# Altium schematic sheet PowCarbinBoard_FPGA.SchDoc
size A3
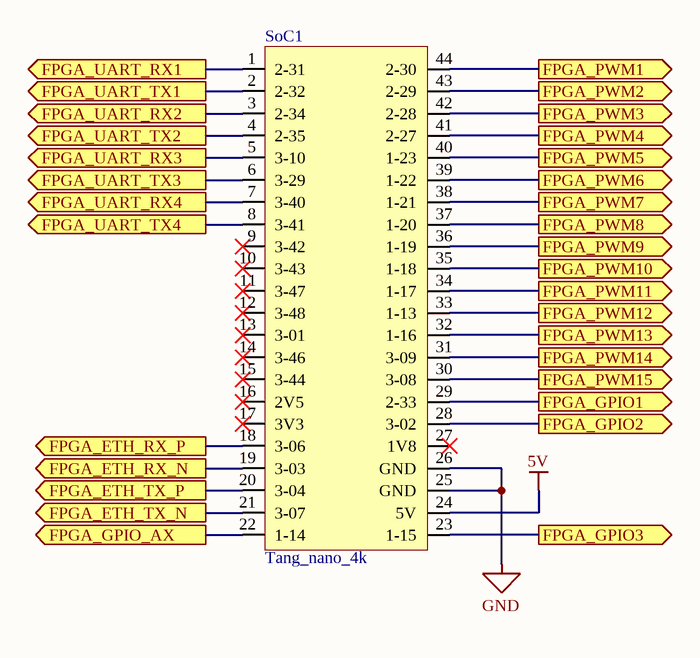
[diagram p0: PowCarbinBoard_FPGA.SchDoc]

## Parts
SoC1  Tang_nano_4k  [SIPEED-TANG_nano_4k]

## Ports
FPGA_ETH_RX_N (out), FPGA_ETH_RX_P (out), FPGA_ETH_TX_N (out), FPGA_ETH_TX_P (out), FPGA_GPIO1 (out), FPGA_GPIO2 (out), FPGA_GPIO3 (out), FPGA_GPIO_AX (out), FPGA_PWM1 (out), FPGA_PWM2 (out), FPGA_PWM3 (out), FPGA_PWM4 (out), FPGA_PWM5 (out), FPGA_PWM6 (out), FPGA_PWM7 (out), FPGA_PWM8 (out), FPGA_PWM9 (out), FPGA_PWM10 (out), FPGA_PWM11 (out), FPGA_PWM12 (out), FPGA_PWM13 (out), FPGA_PWM14 (out), FPGA_PWM15 (out), FPGA_UART_RX1 (out), FPGA_UART_RX2 (out), FPGA_UART_RX3 (out), FPGA_UART_RX4 (out), FPGA_UART_TX1 (out), FPGA_UART_TX2 (out), FPGA_UART_TX3 (out), FPGA_UART_TX4 (out)

## Nets
5V: SoC1.24(5V)
GND: SoC1.25(GND) SoC1.26(GND)
FPGA_ETH_RX_N: SoC1.19(3-03) ; port FPGA_ETH_RX_N
FPGA_ETH_RX_P: SoC1.18(3-06) ; port FPGA_ETH_RX_P
FPGA_ETH_TX_N: SoC1.21(3-07) ; port FPGA_ETH_TX_N
FPGA_ETH_TX_P: SoC1.20(3-04) ; port FPGA_ETH_TX_P
FPGA_GPIO1: SoC1.29(2-33) ; port FPGA_GPIO1
FPGA_GPIO2: SoC1.28(3-02) ; port FPGA_GPIO2
FPGA_GPIO3: SoC1.23(1-15) ; port FPGA_GPIO3
FPGA_GPIO_AX: SoC1.22(1-14) ; port FPGA_GPIO_AX
FPGA_PWM1: SoC1.44(2-30) ; port FPGA_PWM1
FPGA_PWM2: SoC1.43(2-29) ; port FPGA_PWM2
FPGA_PWM3: SoC1.42(2-28) ; port FPGA_PWM3
FPGA_PWM4: SoC1.41(2-27) ; port FPGA_PWM4
FPGA_PWM5: SoC1.40(1-23) ; port FPGA_PWM5
FPGA_PWM6: SoC1.39(1-22) ; port FPGA_PWM6
FPGA_PWM7: SoC1.38(1-21) ; port FPGA_PWM7
FPGA_PWM8: SoC1.37(1-20) ; port FPGA_PWM8
FPGA_PWM9: SoC1.36(1-19) ; port FPGA_PWM9
FPGA_PWM10: SoC1.35(1-18) ; port FPGA_PWM10
FPGA_PWM11: SoC1.34(1-17) ; port FPGA_PWM11
FPGA_PWM12: SoC1.33(1-13) ; port FPGA_PWM12
FPGA_PWM13: SoC1.32(1-16) ; port FPGA_PWM13
FPGA_PWM14: SoC1.31(3-09) ; port FPGA_PWM14
FPGA_PWM15: SoC1.30(3-08) ; port FPGA_PWM15
FPGA_UART_RX1: SoC1.1(2-31) ; port FPGA_UART_RX1
FPGA_UART_RX2: SoC1.3(2-34) ; port FPGA_UART_RX2
FPGA_UART_RX3: SoC1.5(3-10) ; port FPGA_UART_RX3
FPGA_UART_RX4: SoC1.7(3-40) ; port FPGA_UART_RX4
FPGA_UART_TX1: SoC1.2(2-32) ; port FPGA_UART_TX1
FPGA_UART_TX2: SoC1.4(2-35) ; port FPGA_UART_TX2
FPGA_UART_TX3: SoC1.6(3-29) ; port FPGA_UART_TX3
FPGA_UART_TX4: SoC1.8(3-41) ; port FPGA_UART_TX4

Not connected (* = marked no-connect by the designer): SoC1 9(3-42)* 10(3-43)* 11(3-47)* 12(3-48)* 13(3-01)* 14(3-46)* 15(3-44)* 16(2V5)* 17(3V3)* 27(1V8)*

## Library data of the parts
SoC1 = SIPEED-TANG_nano_4k